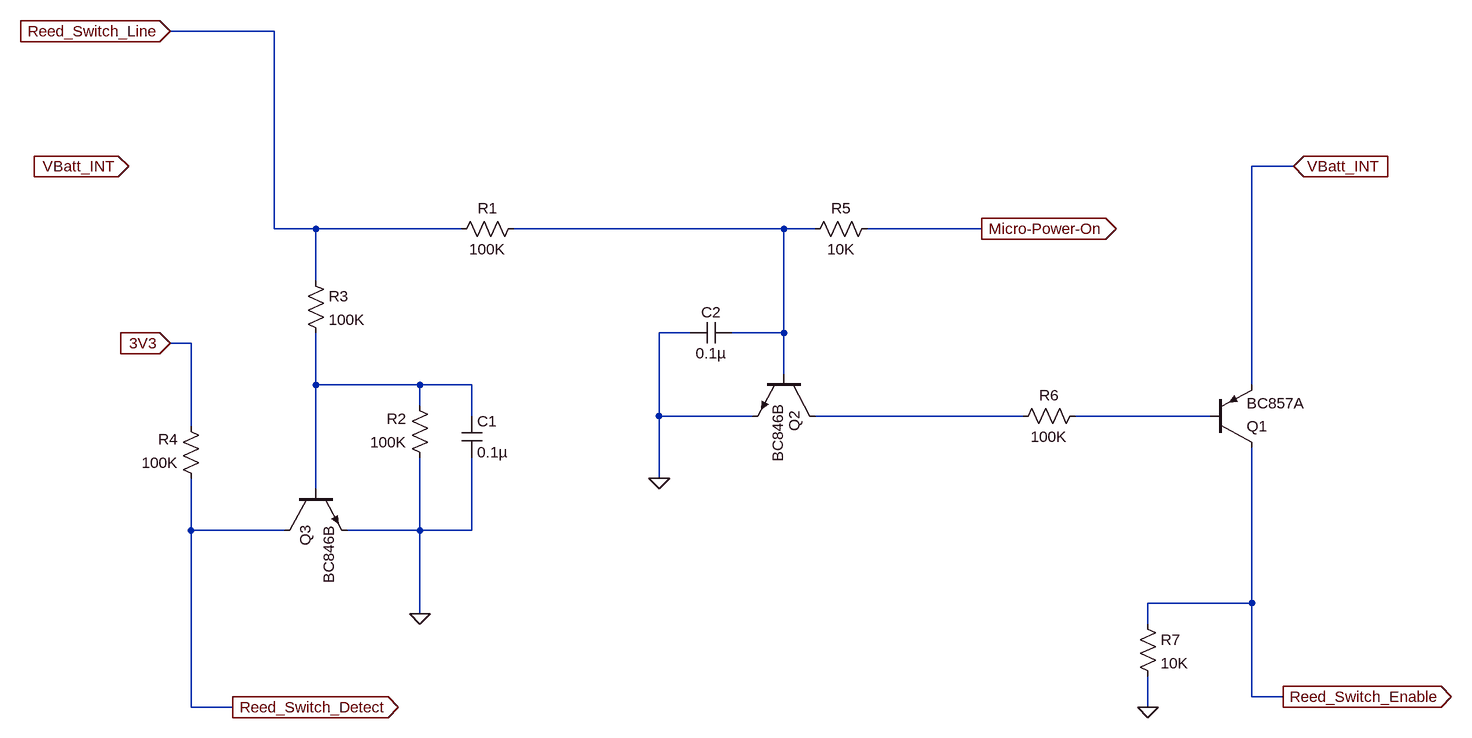
[diagram p0: schematic reed_switch_power.asc]
reed_switch_power.asc, the LTspice schematic file:
Version 4
SHEET 1 1968 1128
WIRE 0 -432 -160 -432
WIRE 1568 -224 1504 -224
WIRE 0 -128 0 -432
WIRE 64 -128 0 -128
WIRE 288 -128 64 -128
WIRE 784 -128 368 -128
WIRE 832 -128 784 -128
WIRE 1088 -128 912 -128
WIRE 64 -48 64 -128
WIRE 640 32 592 32
WIRE 784 32 784 -128
WIRE 784 32 704 32
WIRE -128 48 -160 48
WIRE 784 96 784 32
WIRE 64 112 64 32
WIRE 224 112 64 112
WIRE 304 112 224 112
WIRE 1504 112 1504 -224
WIRE 224 144 224 112
WIRE 304 160 304 112
WIRE 592 160 592 32
WIRE 736 160 592 160
WIRE 1152 160 832 160
WIRE 1440 160 1232 160
WIRE -128 176 -128 48
WIRE 592 256 592 160
WIRE 64 272 64 112
WIRE -128 336 -128 256
WIRE 16 336 -128 336
WIRE 224 336 224 224
WIRE 224 336 112 336
WIRE 304 336 304 224
WIRE 304 336 224 336
WIRE 1504 448 1504 208
WIRE 1504 448 1344 448
WIRE 224 464 224 336
WIRE 1344 480 1344 448
WIRE 1504 592 1504 448
WIRE 1552 592 1504 592
WIRE -128 608 -128 336
WIRE -64 608 -128 608
WIRE 1344 608 1344 560
FLAG 592 256 0
FLAG 224 464 0
FLAG 1568 -224 VBatt_INT
IOPIN 1568 -224 In
FLAG 1552 592 Reed_Switch_Enable
IOPIN 1552 592 Out
FLAG -64 608 Reed_Switch_Detect
IOPIN -64 608 Out
FLAG 1088 -128 Micro-Power-On
IOPIN 1088 -128 Out
FLAG -160 48 3V3
IOPIN -160 48 In
FLAG -160 -432 Reed_Switch_Line
IOPIN -160 -432 In
FLAG -224 -224 VBatt_INT
IOPIN -224 -224 In
FLAG 1344 608 0
SYMBOL res 384 -144 R90
WINDOW 0 0 56 VBottom 2
WINDOW 3 32 56 VTop 2
SYMATTR InstName R1
SYMATTR Value 100K
SYMATTR SpiceLine tol=1 pwr=0.1
SYMBOL res 240 240 R180
WINDOW 0 36 76 Left 2
WINDOW 3 36 40 Left 2
SYMATTR InstName R2
SYMATTR Value 100K
SYMATTR SpiceLine tol=1 pwr=0.1
SYMBOL res 48 -64 R0
SYMATTR InstName R3
SYMATTR Value 100K
SYMATTR SpiceLine tol=1 pwr=0.1
SYMBOL res -112 272 R180
WINDOW 0 36 76 Left 2
WINDOW 3 36 40 Left 2
SYMATTR InstName R4
SYMATTR Value 100K
SYMATTR SpiceLine tol=1 pwr=0.1
SYMBOL res 816 -112 R270
WINDOW 0 32 56 VTop 2
WINDOW 3 0 56 VBottom 2
SYMATTR InstName R5
SYMATTR Value 10K
SYMATTR SpiceLine tol=1 pwr=0.1
SYMBOL res 1136 176 R270
WINDOW 0 32 56 VTop 2
WINDOW 3 0 56 VBottom 2
SYMATTR InstName R6
SYMATTR Value 100K
SYMATTR SpiceLine tol=1 pwr=0.1
SYMBOL pnp 1440 208 M180
SYMATTR InstName Q1
SYMATTR Value BC857A
SYMBOL npn 832 96 R90
WINDOW 3 45 57 Left 2
SYMATTR Value BC846B
SYMATTR InstName Q2
SYMBOL npn 16 272 M90
SYMATTR InstName Q3
SYMATTR Value BC846B
SYMBOL cap 288 160 R0
SYMATTR InstName C1
SYMATTR Value 0.1µ
SYMATTR SpiceLine V=4 Irms=0 Rser=0 Lser=0 mfg="Murata" pn="GRM022R60G333KE15" type="X5R"
SYMBOL cap 704 16 R90
WINDOW 0 0 32 VBottom 2
WINDOW 3 32 32 VTop 2
SYMATTR InstName C2
SYMATTR Value 0.1µ
SYMATTR SpiceLine V=4 Irms=0 Rser=0 Lser=0 mfg="Murata" pn="GRM022R60G333KE15" type="X5R"
SYMBOL res 1328 464 R0
SYMATTR InstName R7
SYMATTR Value 10K
SYMATTR SpiceLine tol=1 pwr=0.1

The netlist it stands for:
* reed_switch_power.asc
R1 N001 Reed_Switch_Line 100K tol=1 pwr=0.1
R2 0 N002 100K tol=1 pwr=0.1
R3 Reed_Switch_Line N002 100K tol=1 pwr=0.1
R4 Reed_Switch_Detect 3V3 100K tol=1 pwr=0.1
R5 N001 Micro-Power-On 10K tol=1 pwr=0.1
R6 N003 N004 100K tol=1 pwr=0.1
Q1 Reed_Switch_Enable N004 VBatt_INT 0 BC857A
Q2 N003 N001 0 0 BC846B
Q3 Reed_Switch_Detect N002 0 0 BC846B
C1 N002 0 0.1µ V=4 Irms=0 Rser=0 Lser=0 mfg="Murata" pn="GRM022R60G333KE15" type="X5R"
C2 N001 0 0.1µ V=4 Irms=0 Rser=0 Lser=0 mfg="Murata" pn="GRM022R60G333KE15" type="X5R"
R7 Reed_Switch_Enable 0 10K tol=1 pwr=0.1
.model NPN NPN
.model PNP PNP
.lib standard.bjt
.backanno
.end